# EasyEDA Pro project P1.eprj, board PCB5
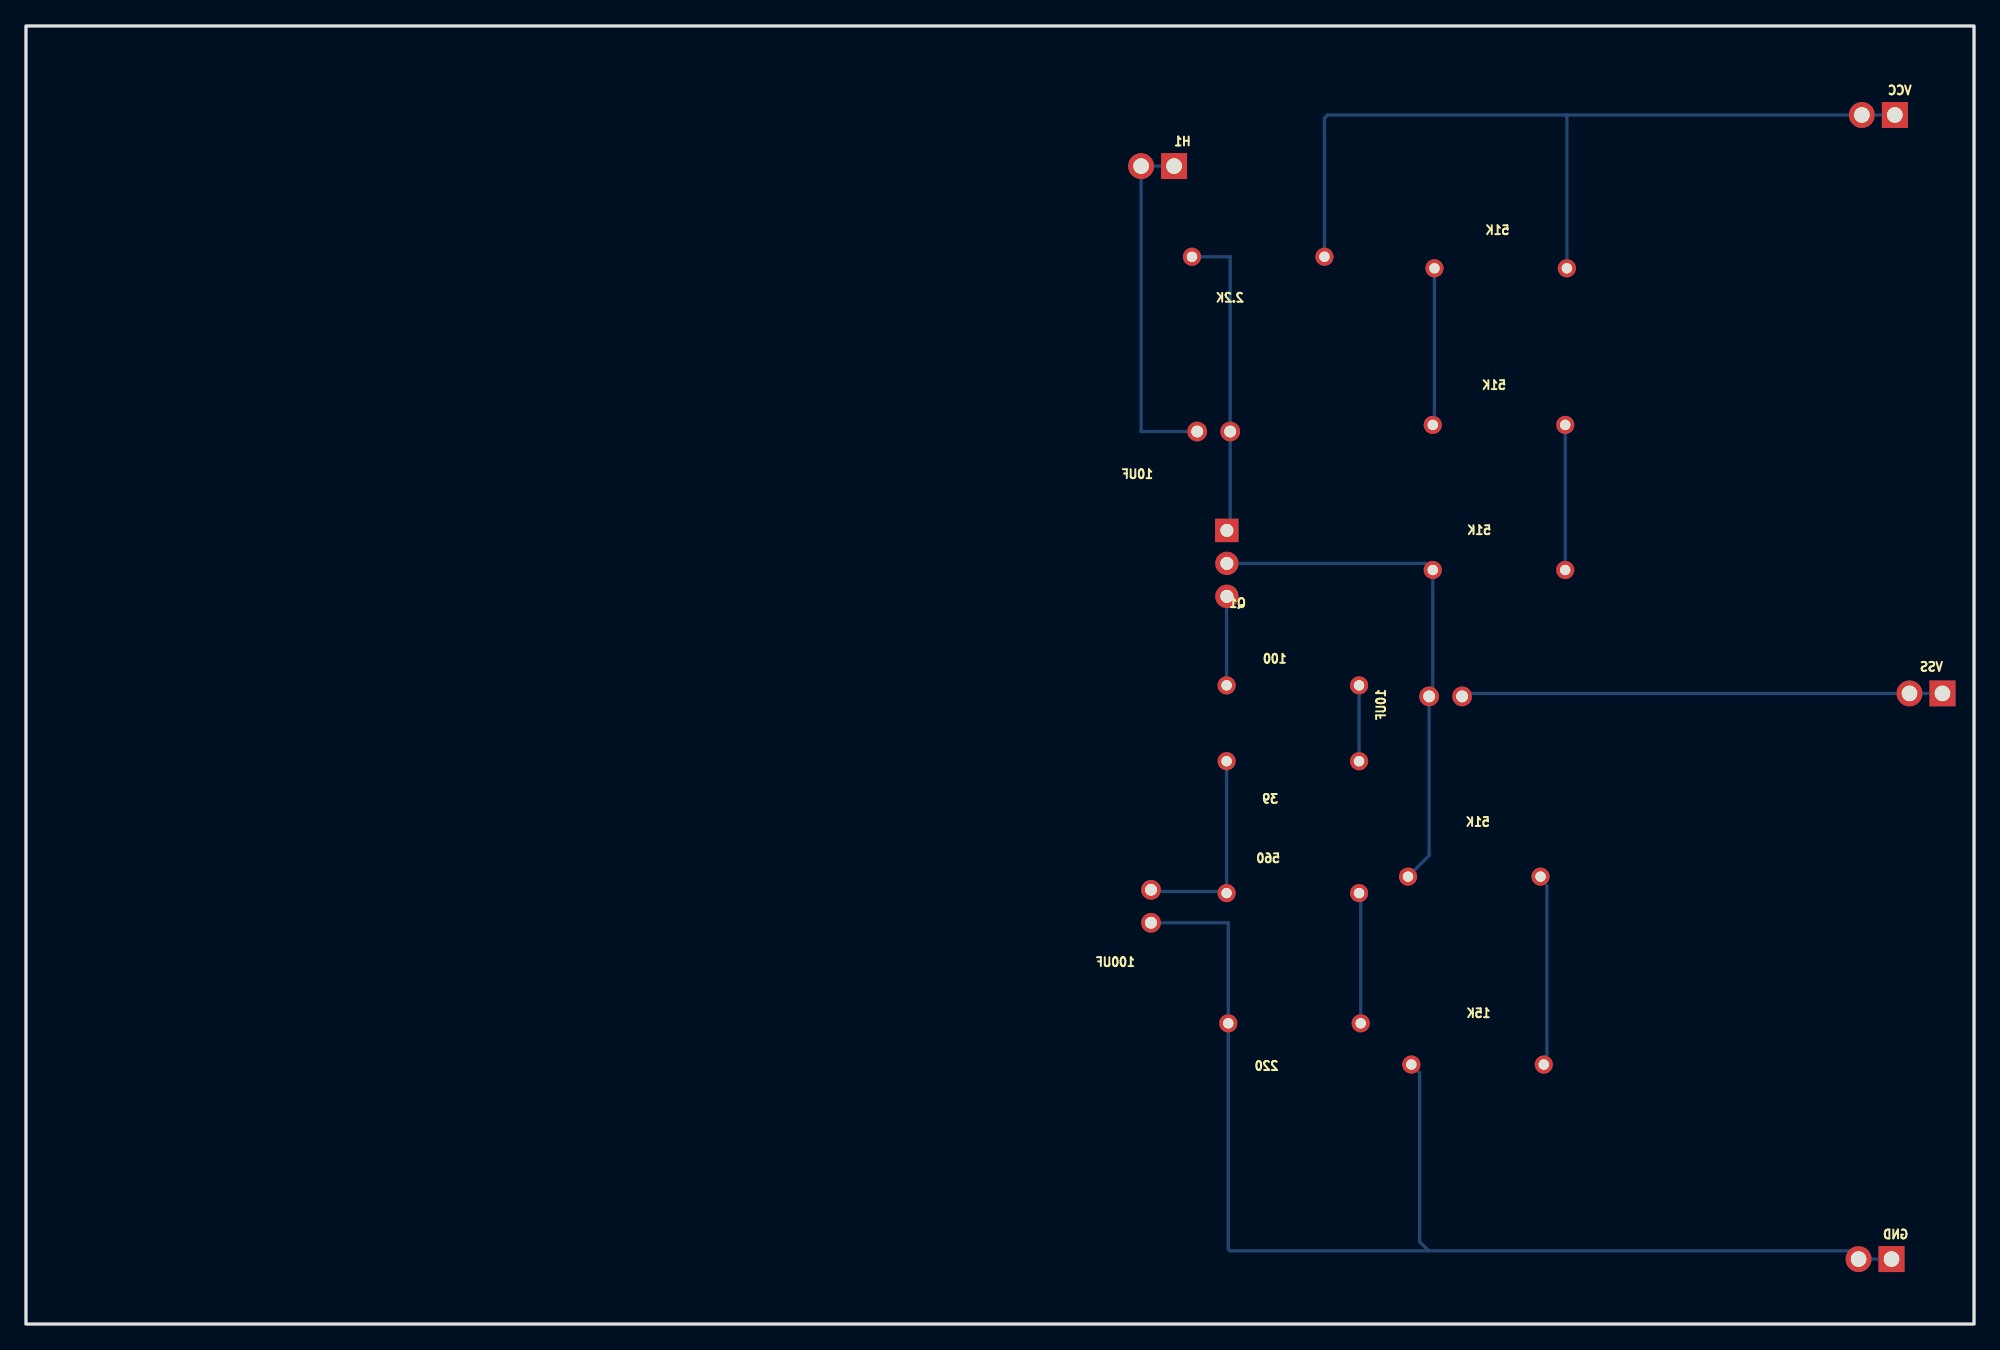
[diagram p8: board, top side]
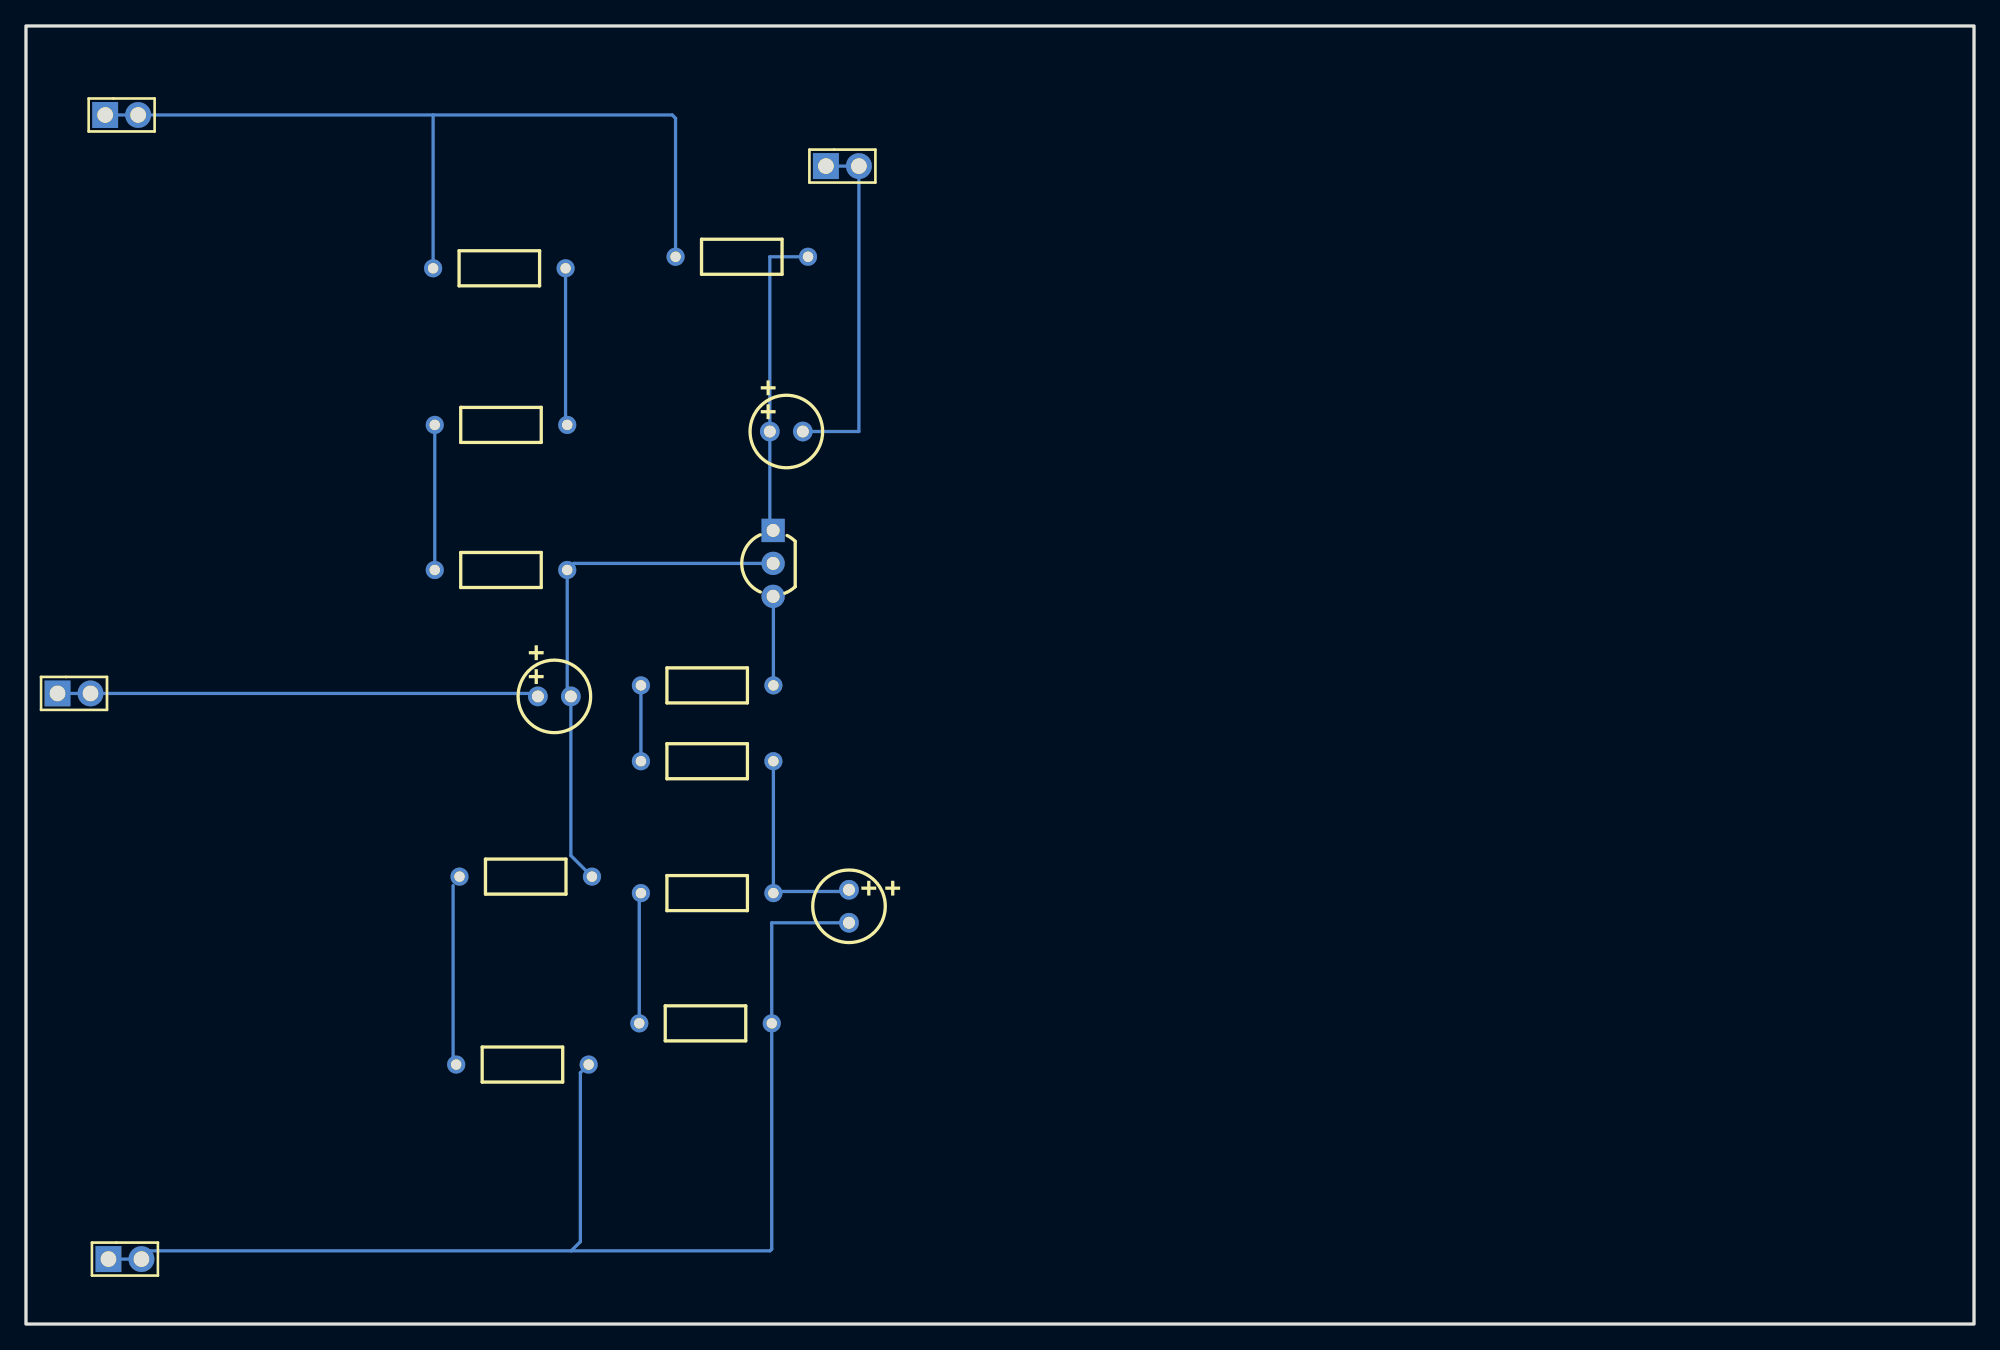
[diagram p9: board, bottom side, seen from below]

Outline 150 x 100 mm; copper layers: Top Layer, Bottom Layer. Coordinates in mm from the lower left corner of the outline.
Outline path: rectangle 0,100 150,0
Stack: Top Layer 0.035mm / Dielectric1 1.51mm FR4 er 4.5 / Bottom Layer 0.035mm

## Design rules (mm)
template: JLCPCB Capability(Two Layers Board)
spacing copperThickness1oz (default): track to track 0.102, other pairs 0.152 to 0.3
spacing copperThickness2oz: track to track 0.203, other pairs 0.152 to 0.3
track width copperThickness1oz (default): min 0.127, default 0.254, max 2.54
track width copperThickness2oz: min 0.203, default 0.254, max 2.54
differential pair differentialPair (default): width min 0.127, default 0.254, max 2.54; gap min 0.152, default 0.152
via viaSize (default): diameter min 0.5, default 0.61, max 10; hole min 0.3, default 0.305, max 6.3

## Placement (name value [footprint] x y rotation side)
2.2K  2.2k  [RES-TH_BD2.7-L6.2-P10.20-D0.4]  94.88 82.22 0 bottom
10UF  -  [CAP-TH_BD5.5-P2.54-D0.5-FD]  109.31 48.35 0 bottom
10UF#2  -  [CAP-TH_BD5.5-P2.54-D0.5-FD]  91.45 68.76 0 bottom
15K  15K  [RES-TH_BD2.7-L6.2-P10.20-D0.4]  111.77 19.99 180 bottom
39  39  [RES-TH_BD2.7-L6.2-P10.20-D0.4]  97.55 43.36 0 bottom
51K  -  [RES-TH_BD2.7-L6.2-P10.20-D0.4]  113.42 58.09 0 bottom
51K#2  -  [RES-TH_BD2.7-L6.2-P10.20-D0.4]  113.55 81.33 0 bottom
51K#3  -  [RES-TH_BD2.7-L6.2-P10.20-D0.4]  113.42 69.27 180 bottom
51K#4  -  [RES-TH_BD2.7-L6.2-P10.20-D0.4]  111.52 34.47 180 bottom
100  100  [RES-TH_BD2.7-L6.2-P10.20-D0.4]  97.55 49.2 180 bottom
100UF  100uF  [CAP-TH_BD5.5-P2.54-D0.5-FD]  86.63 32.18 90 bottom
220  220  [RES-TH_BD2.7-L6.2-P10.20-D0.4]  97.68 23.16 0 bottom
560  560  [RES-TH_BD2.7-L6.2-P10.20-D0.4]  97.55 33.2 180 bottom
GND  PZ254V-11-05P  [HDR-TH_2P-P2.54-V-M]  142.38 5 180 bottom
H1  PZ254V-11-02P  [HDR-TH_2P-P2.54-V-M]  87.14 89.21 180 bottom
Q1  2N2222A  [TO-92-3_L4.8-W3.7-P2.54-R]  92.47 58.6 90 bottom
VCC  PZ254V-11-02P  [HDR-TH_2P-P2.54-V-M]  142.63 93.14 180 bottom
VSS  PZ254V-11-02P  [HDR-TH_2P-P2.54-V-M]  146.3 48.58 180 bottom

## Footprints (pads in the part's own frame, mm; a bottom-side part is the same pattern mirrored in y, then rotated)
CAP-TH_BD5.5-P2.54-D0.5-FD
  round 1.524 hole 0.914: 1(-1.27,0) 2(1.27,0)
HDR-TH_2P-P2.54-V-M
  rect 2x2 hole 1.2: 1(-1.27,0)
  round 2 hole 1.2: 2(1.27,0)
RES-TH_BD2.7-L6.2-P10.20-D0.4
  round 1.4 hole 0.8: 1(-5.1,0) 2(5.1,0)
TO-92-3_L4.8-W3.7-P2.54-R
  rect 1.8x1.8 hole 1: 1(2.54,0)
  round 1.8 hole 1: 2(0,0) 3(-2.54,0)

## Nets
$1N470: 2.2K.2 51K#2.2 VCC.1 VCC.2
$1N487: 51K#2.1 51K#3.2
$1N500: 51K.2 51K#3.1
$1N505: 10UF.1 51K.1 51K#4.2 Q1.2
$1N510: 15K.1 51K#4.1
$1N515: 15K.2 100UF.1 220.1 GND.1 GND.2
$1N539: 10UF.2 VSS.1 VSS.2
$1N1031: 2.2K.1 10UF#2.2 Q1.1
$1N1035: 100.2 Q1.3
$1N1037: 39.2 100.1
$1N1039: 39.1 100UF.2 560.2
$1N1078: 220.2 560.1
$1N1129: 10UF#2.1 H1.1 H1.2

## Routing (per net, layer and track width the routed paths; a pad name or vN(x,y) marks a point on that pad's centre or on a via; arc(x,y) is an arc through that point)
$1N470: length 66.5
  Bottom Layer w0.254: 118.65,93.14 51K#2.2 ; 118.65,93.14 100.24,93.14 99.98,92.89 2.2K.2 ; 118.65,93.14 VCC.2 VCC.1
$1N487: length 12.1
  Bottom Layer w0.254: 51K#2.1 108.45,69.39 51K#3.2
$1N500: length 11.2
  Bottom Layer w0.254: 118.52,69.27 118.52,58.09
$1N505: length 40.5
  Bottom Layer w0.254: 51K#4.2 108.04,36.09 10UF.1 108.32,48.63 51K.1 107.82,58.6 Q1.2
$1N510: length 14
  Bottom Layer w0.254: 117.11,33.78 117.11,20.43 116.67,19.99
$1N515: length 97.4
  Bottom Layer w0.254: 108.01,5.64 140.48,5.64 GND.2 143.65,5 ; 108.01,5.64 92.71,5.64 92.58,5.77 220.1 92.58,30.91 100UF.1 ; 108.01,5.64 107.31,6.34 107.31,19.35 15K.2
$1N539: length 37.1
  Bottom Layer w0.254: VSS.1 VSS.2 110.81,48.58 10UF.2
$1N1031: length 24.1
  Bottom Layer w0.254: Q1.1 92.72,61.39 10UF#2.2 92.72,82.22 2.2K.1
$1N1035: length 6.9
  Bottom Layer w0.254: Q1.3 92.45,56.04 100.2
$1N1037: length 5.8
  Bottom Layer w0.254: 100.1 39.2
$1N1039: length 16.1
  Bottom Layer w0.254: 92.45,33.45 92.32,33.33 86.75,33.33 100UF.2 ; 92.45,33.45 560.2 ; 92.45,33.45 39.1
$1N1078: length 10.1
  Bottom Layer w0.254: 560.1 102.78,33.07 220.2
$1N1129: length 27.3
  Bottom Layer w0.254: H1.1 H1.2 85.86,68.76 10UF#2.1
